# EAGLE design Dispenser (EAGLE 6.3)
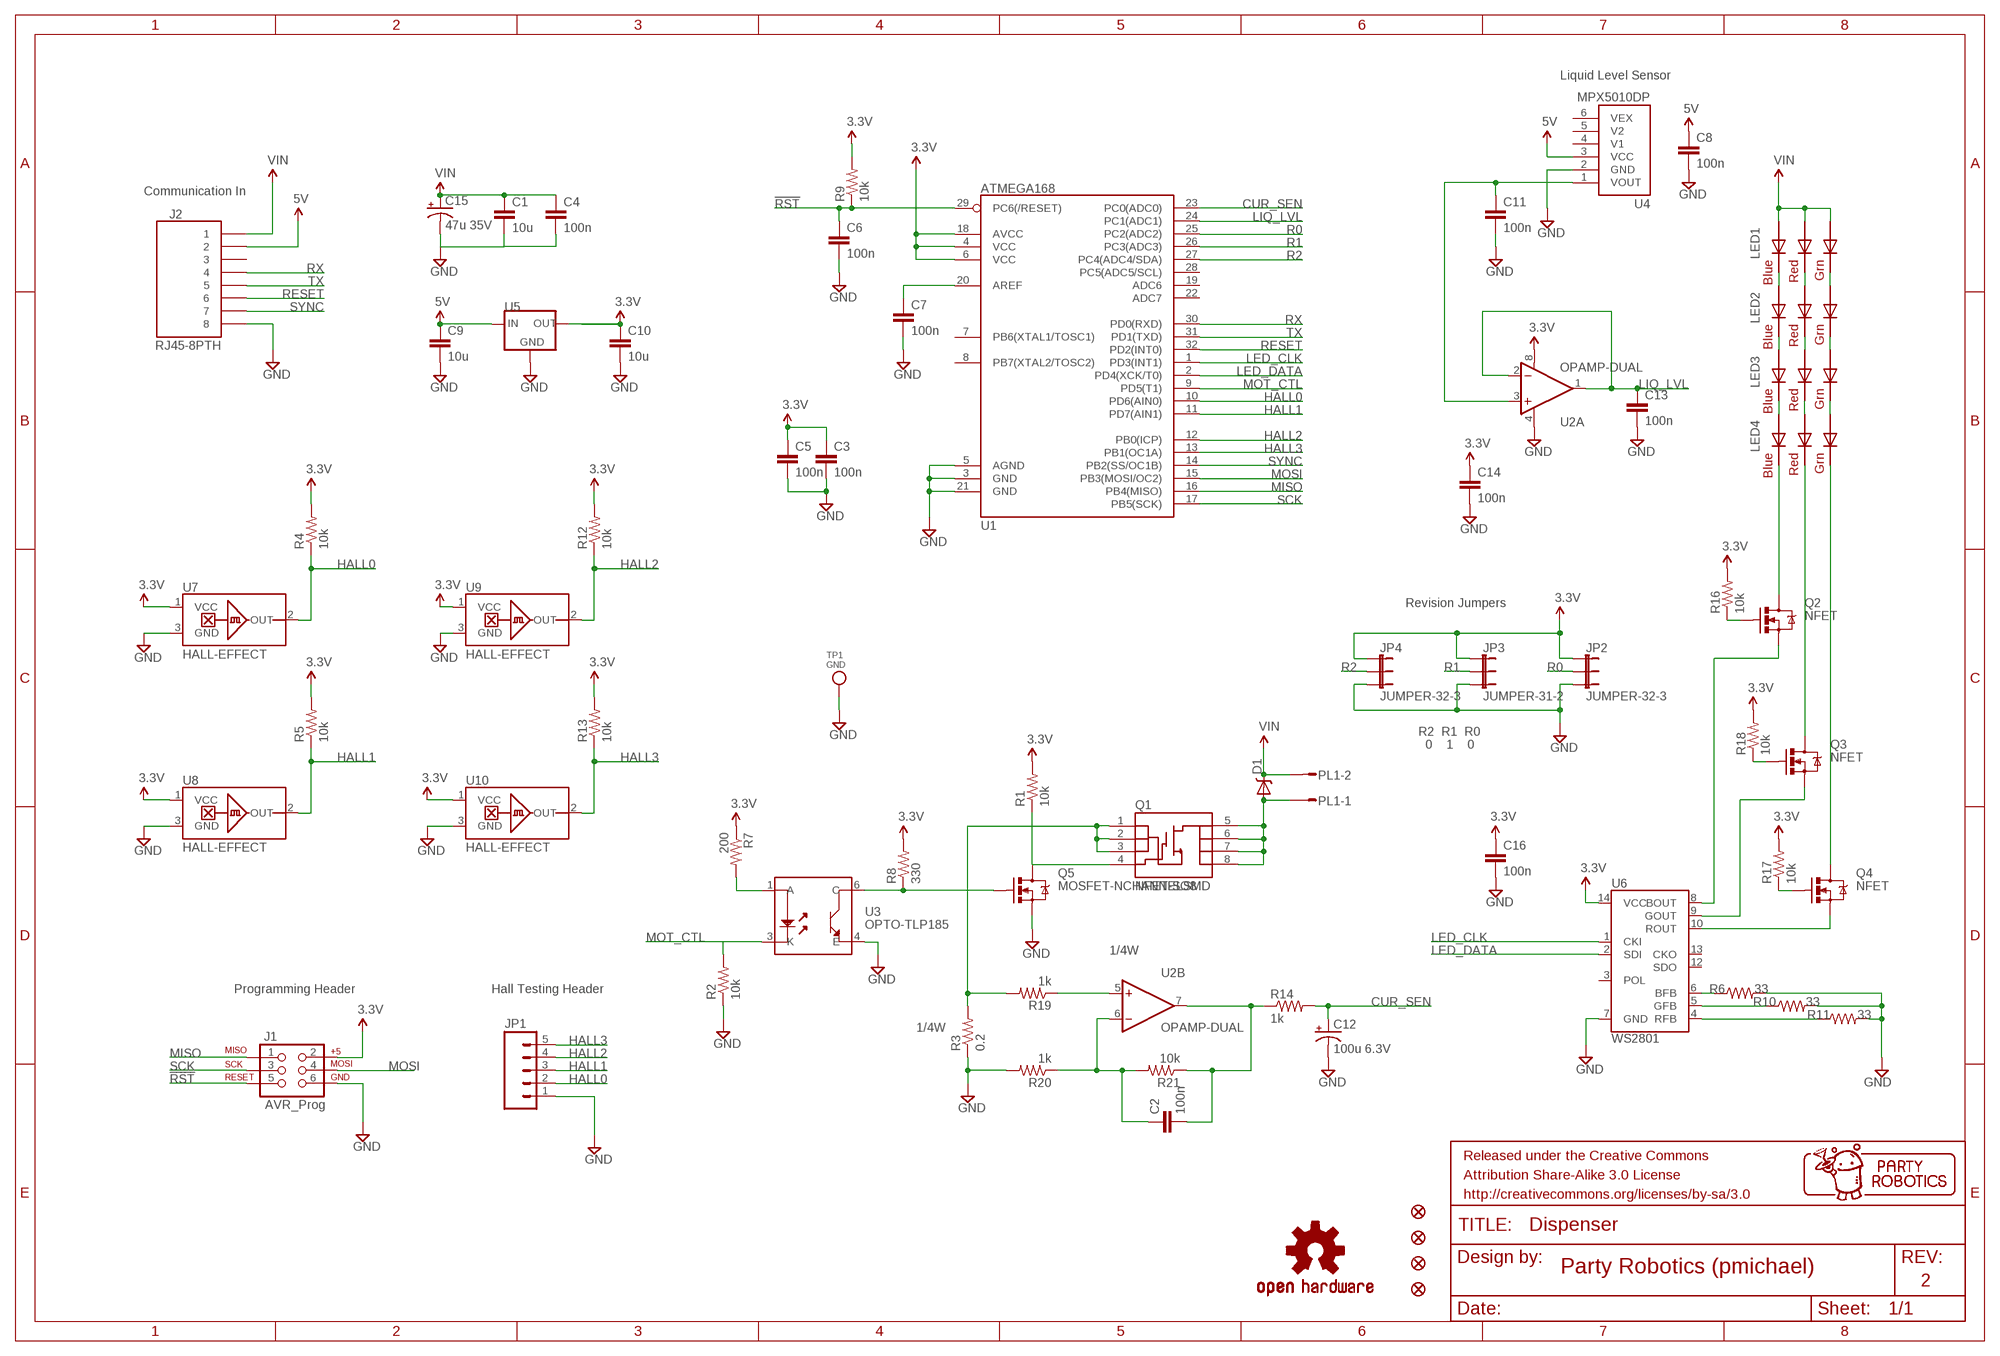
[diagram p0: schematic, sheet 1]

## Parts
C1  10u  CAP0603-CAP  [0603-CAP]
C2  100n  CAP0603-CAP  [0603-CAP]
C3  100n  CAP0603-CAP  [0603-CAP]
C4  100n  CAP0603-CAP  [0603-CAP]
C5  100n  CAP0603-CAP  [0603-CAP]
C6  100n  CAP0603-CAP  [0603-CAP]
C7  100n  CAP0603-CAP  [0603-CAP]
C8  100n  CAP0603-CAP  [0603-CAP]
C9  10u  CAP0603-CAP  [0603-CAP]
C10  10u  CAP0603-CAP  [0603-CAP]
C11  100n  CAP0603-CAP  [0603-CAP]
C12  100u 6.3V  CAP_POLD  [PANASONIC_D]
C13  100n  CAP0603-CAP  [0603-CAP]
C14  100n  CAP0603-CAP  [0603-CAP]
C15  47u 35V  CAP_POLD  [PANASONIC_D]
C16  100n  CAP0603-CAP  [0603-CAP]
D1  B330A  [SMA-DIODE]
FRAME3  FRAME-LETTER  [CREATIVE_COMMONS]
J1  AVR_Prog  AVR_SPI_PRG_62X3_LOCK  [2X3_LOCK]
J2  RJ45-8PTH  [RJ45-8]
JP1  M051.27MM  [1X05-1.27MM]
JP2  JUMPER-32-3  [SJ_3_PASTE2&3]
JP3  JUMPER-31-2  [SJ_3_PASTE1&2]
JP4  JUMPER-32-3  [SJ_3_PASTE2&3]
JP5  FIDUCIAL1X2  [FIDUCIAL-1X2]
JP6  FIDUCIAL1X2  [FIDUCIAL-1X2]
JP7  FIDUCIAL1X2  [FIDUCIAL-1X2]
JP8  FIDUCIAL1X2  [FIDUCIAL-1X2]
LED1  RGBLED5050  [RGBLED5050]
LED2  RGBLED5050  [RGBLED5050]
LED3  RGBLED5050  [RGBLED5050]
LED4  RGBLED5050  [RGBLED5050]
PL1  DF3-02P  [DF3P-02]
Q1  NFET-SO8  [SO08]
Q2  NFET  MOSFET-NCHANNELSMD  [SOT23-3]
Q3  NFET  MOSFET-NCHANNELSMD  [SOT23-3]
Q4  NFET  MOSFET-NCHANNELSMD  [SOT23-3]
Q5  MOSFET-NCHANNELSMD  [SOT23-3]
R1  10k  RESISTOR0603-RES  [0603-RES]
R2  10k  RESISTOR0603-RES  [0603-RES]
R3  0.2  RESISTOR0805-RES  [0805]
R4  10k  RESISTOR0603-RES  [0603-RES]
R5  10k  RESISTOR0603-RES  [0603-RES]
R6  33  RESISTOR0603-RES  [0603-RES]
R7  200  RESISTOR0603-RES  [0603-RES]
R8  330  RESISTOR0603-RES  [0603-RES]
R9  10k  RESISTOR0603-RES  [0603-RES]
R10  33  RESISTOR0603-RES  [0603-RES]
R11  33  RESISTOR0603-RES  [0603-RES]
R12  10k  RESISTOR0603-RES  [0603-RES]
R13  10k  RESISTOR0603-RES  [0603-RES]
R14  1k  RESISTOR0603-RES  [0603-RES]
R16  10k  RESISTOR0603-RES  [0603-RES]
R17  10k  RESISTOR0603-RES  [0603-RES]
R18  10k  RESISTOR0603-RES  [0603-RES]
R19  1k  RESISTOR0603-RES  [0603-RES]
R20  1k  RESISTOR0603-RES  [0603-RES]
R21  10k  RESISTOR0603-RES  [0603-RES]
TP1  GND  TESTPOINT  [TESTPOINT_SMT]
U1  ATMEGA168  [TQFP32-08]
U2  OPAMP-DUAL  OPAMP-DUALU  [SO08]
U3  OPTO-TLP185  [SO6]
U4  MPX5010DP  [MPX5010DP]
U5  VREG-5V-LDO-AP1117SOT89-3L  [SOT89-3L]
U6  WS2801  [SOP-14]
U7  HALL-EFFECT  [SOT23-3]
U8  HALL-EFFECT  [SOT23-3]
U9  HALL-EFFECT  [SOT23-3]
U10  HALL-EFFECT  [SOT23-3]
U$1  OSHW-LOGOM  [OSHW-LOGO-M]

## Nets
1/4W: Q1.1(S) Q1.2(S) Q1.3(S) R3.2 R19.2
3.3V: C3.1 C5.1 C8.1 C10.1 C14.1 C16.1 J1.2 JP2.1 JP3.1 JP4.1 R1.2 R4.2 R5.2 R7.1 R8.2 R9.2 R12.2 R13.2 R16.2 R17.2 R18.2 U1.4(VCC) U1.6(VCC) U1.18(AVCC) U2.8(A:V+) U5.2(OUT) U5.2.1(OUT) U6.14(VCC) U7.1(VCC) U8.1(VCC) U9.1(VCC) U10.1(VCC) ; supply symbol labelled 5V
5V: C9.1 J2.2 U4.3(VCC) U5.3(IN)
!RST: C6.1 J1.5 R9.1 U1.29(PC6(/RESET))
BLUE: Q2.2(S) U6.8(BOUT)
CUR_SEN: C12.+ R14.2 U1.23(PC0(ADC0))
GND: C1.2 C3.2 C4.2 C5.2 C6.2 C7.2 C8.2 C9.2 C10.2 C11.2 C12.- C13.2 C14.2 C15.- C16.2 J1.6 J2.8 JP1.1 JP2.3 JP3.3 JP4.3 Q5.2(S) R2.1 R3.1 R6.2 R10.2 R11.2 R20.2 TP1.P$1 U1.3(GND) U1.5(AGND) U1.21(GND) U2.4(A:V-) U3.4(E) U4.2(GND) U5.1(GND) U6.7(GND) U7.3(GND) U8.3(GND) U9.3(GND) U10.3(GND)
GREEN: Q3.2(S) U6.9(GOUT)
HALL0: JP1.2 R4.1 U1.10(PD6(AIN0)) U7.2(OUT)
HALL1: JP1.3 R5.1 U1.11(PD7(AIN1)) U8.2(OUT)
HALL2: JP1.4 R12.1 U1.12(PB0(ICP)) U9.2(OUT)
HALL3: JP1.5 R13.1 U1.13(PB1(OC1A)) U10.2(OUT)
LED_CLK: U1.1(PD3(INT1)) U6.1(CKI)
LED_DATA: U1.2(PD4(XCK/T0)) U6.2(SDI)
LIQ_LVL: C13.1 U1.24(PC1(ADC1)) U2.1(A:OUT) U2.2(A:-IN)
MISO: J1.1 U1.16(PB4(MISO))
MOSI: J1.4 U1.15(PB3(MOSI/OC2))
MOT_B: D1.A PL1.1 Q1.5(D) Q1.6(D) Q1.7(D) Q1.8(D)
MOT_CTL: R2.2 U1.9(PD5(T1)) U3.3(K)
MOT_CUR: C2.2 R14.1 R21.1 U2.7(B:OUT)
N$1: C7.1 U1.20(AREF)
N$2: Q3.1(G) R18.1
N$4: Q4.1(G) R17.1
N$5: Q2.1(G) R16.1
N$6: R6.1 U6.6(BFB)
N$7: R10.1 U6.5(GFB)
N$8: R11.1 U6.4(RFB)
N$9: Q1.4(G) Q5.3(D) R1.1
N$10: C2.1 R20.1 R21.2 U2.6(B:-IN)
N$11: R19.1 U2.5(B:+IN)
N$12: LED4.6(BLUE_C) Q2.3(D)
N$13: LED4.5(RED_C) Q3.3(D)
N$14: LED4.4(GREEN_C) Q4.3(D)
N$16: R7.2 U3.1(A)
N$17: Q4.2(S) U6.10(ROUT)
N$26: C11.1 U2.3(A:+IN) U4.1(VOUT)
N$28: LED3.6(BLUE_C) LED4.1(BLUE_A)
N$31: Q5.1(G) R8.1 U3.6(C)
N$34: LED3.5(RED_C) LED4.2(RED_A)
N$37: LED3.4(GREEN_C) LED4.3(GREEN_A)
N$38: LED2.4(GREEN_C) LED3.3(GREEN_A)
N$39: LED2.5(RED_C) LED3.2(RED_A)
N$40: LED2.6(BLUE_C) LED3.1(BLUE_A)
N$41: LED1.4(GREEN_C) LED2.3(GREEN_A)
N$42: LED1.5(RED_C) LED2.2(RED_A)
N$43: LED1.6(BLUE_C) LED2.1(BLUE_A)
R0: JP2.2 U1.25(PC2(ADC2))
R1: JP3.2 U1.26(PC3(ADC3))
R2: JP4.2 U1.27(PC4(ADC4/SDA))
RESET: J2.6 U1.32(PD2(INT0))
RX: J2.4 U1.30(PD0(RXD))
SCK: J1.3 U1.17(PB5(SCK))
SYNC: J2.7 U1.14(PB2(SS/OC1B))
TX: J2.5 U1.31(PD1(TXD))
VIN: C1.1 C4.1 C15.+ D1.C J2.1 LED1.1(BLUE_A) LED1.2(RED_A) LED1.3(GREEN_A) PL1.2
Unconnected: J2.3 U1.7(PB6(XTAL1/TOSC1)) U1.8(PB7(XTAL2/TOSC2)) U1.19(ADC6) U1.22(ADC7) U1.28(PC5(ADC5/SCL)) U4.4(V1) U4.5(V2) U4.6(VEX) U6.3(POL) U6.12(SDO) U6.13(CKO)

## Notes on the sheet
- Liquid Level Sensor
- Communication In
- Revision Jumpers
- R2  R1  R0
- 0    1    0
- Programming Header | Hall Testing Header
- Party Robotics (pmichael)
- 2
- C:/Users/Pierre/Dropbox/PartyRobotics/PartyRoboticsLogo/BW/Eagle-sch-logo.bmp

## Library data of the parts
C1 C9 C10 = SparkFun-Passives:CAP: Capacitor Standard 0603 ceramic capacitor, and 0.1" leaded capacitor.
C2-C8 C11 C13 C14 C16 = SparkFun:CAP: Capacitor Standard 0603 ceramic capacitor, and 0.1" leaded capacitor.
C12 C15 = SparkFun-Capacitors:CAP_POL: Capacitor Polarized These are standard SMD and PTH capacitors. Normally 10uF, 47uF, and 100uF in electrolytic and tantalum varieties. Always verify the external diameter of the through hole cap, it varies with capacity, voltage, and manufacturer. The EIA devices should be standard.
D1 = pierre:B330A: Schottky Diode 3A-30V; PROD_ID: DIO-09886
FRAME3 = SparkFun-Aesthetics:FRAME-LETTER: Schematic Frame Standard 8.5x11 US Letter frame
J1 = SparkFun-Connectors:AVR_SPI_PRG_6: AVR ISP 6 Pin This is the reduced ISP connector for AVR programming. Common on Arduino. This footprint will take up less PCB space and can be used with a 10-pin to 6-pin adapter such as SKU: BOB-08508
J2 = pierre:RJ45-8: RJ45 Jack Simple RJ45, 8-pin connection - connector for common Cat5, Cat5e, and Cat6 Ethernet cables. Footprint not yet proven in production. Connector sku is PRT-00643; Breakout PCB sku is BOB-00716.
JP1 = SparkFun:M05: Header 5 Standard 5-pin 0.1" header. Use with straight break away headers (SKU : PRT-00116), right angle break away headers (PRT-00553), swiss pins (PRT-00743), machine pins (PRT-00117), and female headers (PRT-00115). Molex polarized connector foot print use with SKU : PRT-08230 with associated crimp pins and housings.
JP2-JP4 = SparkFun-Passives:JUMPER-3
JP5-JP8 = SparkFun-Aesthetics:FIDUCIAL: Fiducial Alignment Points Various fiducial points for machine vision alignment.
LED1-LED4 = pierre:RGBLED: For 5050 RGB LEDs, the order of the LEDs may vary from one manufacturer to another!
PL1 = pierre:DF3-02: Single row connector 2mm 2 way
Q1 = pierre:NFET-SO8: IRF9410, NDS8434 & DMN3018SSS SOIC-8 parts.
Q2-Q5 = SparkFun-DiscreteSemi:MOSFET-NCHANNEL: Generic NMOS footprint
R1-R14 R16-R21 = SparkFun-Resistors:RESISTOR: Resistor Basic schematic elements and footprints for 0603, 1206, and PTH resistors.
TP1 = microbuilder:TESTPOINT: Test Point Various test points for characterisation and PCB testing TESTPOINT_SMT - Compact Surface Mount Test Point [Digikey: 5016KTR-ND]
U1 = SparkFun-DigitalIC:ATMEGA168: Atmel 32-pin 8-bit micro, 16k flash.
U2 = SparkFun-AnalogIC:OPAMP-DUAL: Generic op-amp footprint
U3 = pierre:OPTO-TLP185
U4 = pierre:MPX5010DP
U5 = pierre:VREG-5V-LDO-AP1117
U6 = SparkFun-DigitalIC:WS2801: WS2801 3 Channel Constant Current LED Driver with programmable PWM outputs. Datasheet: http://www.sparkfun.com/datasheets/Components/LED/WS2801.pdf
U7-U10 = pierre:HALL-EFFECT: Hall effect sensor in SC70 package
U$1 = pierre:OSHW-LOGO: Open Source Hardware Logo This logo indicates the piece of hardware it is found on incorporates a OSHW license and/or adheres to the definition of open source hardware found here: http://freedomdefined.org/OSHW

## Board
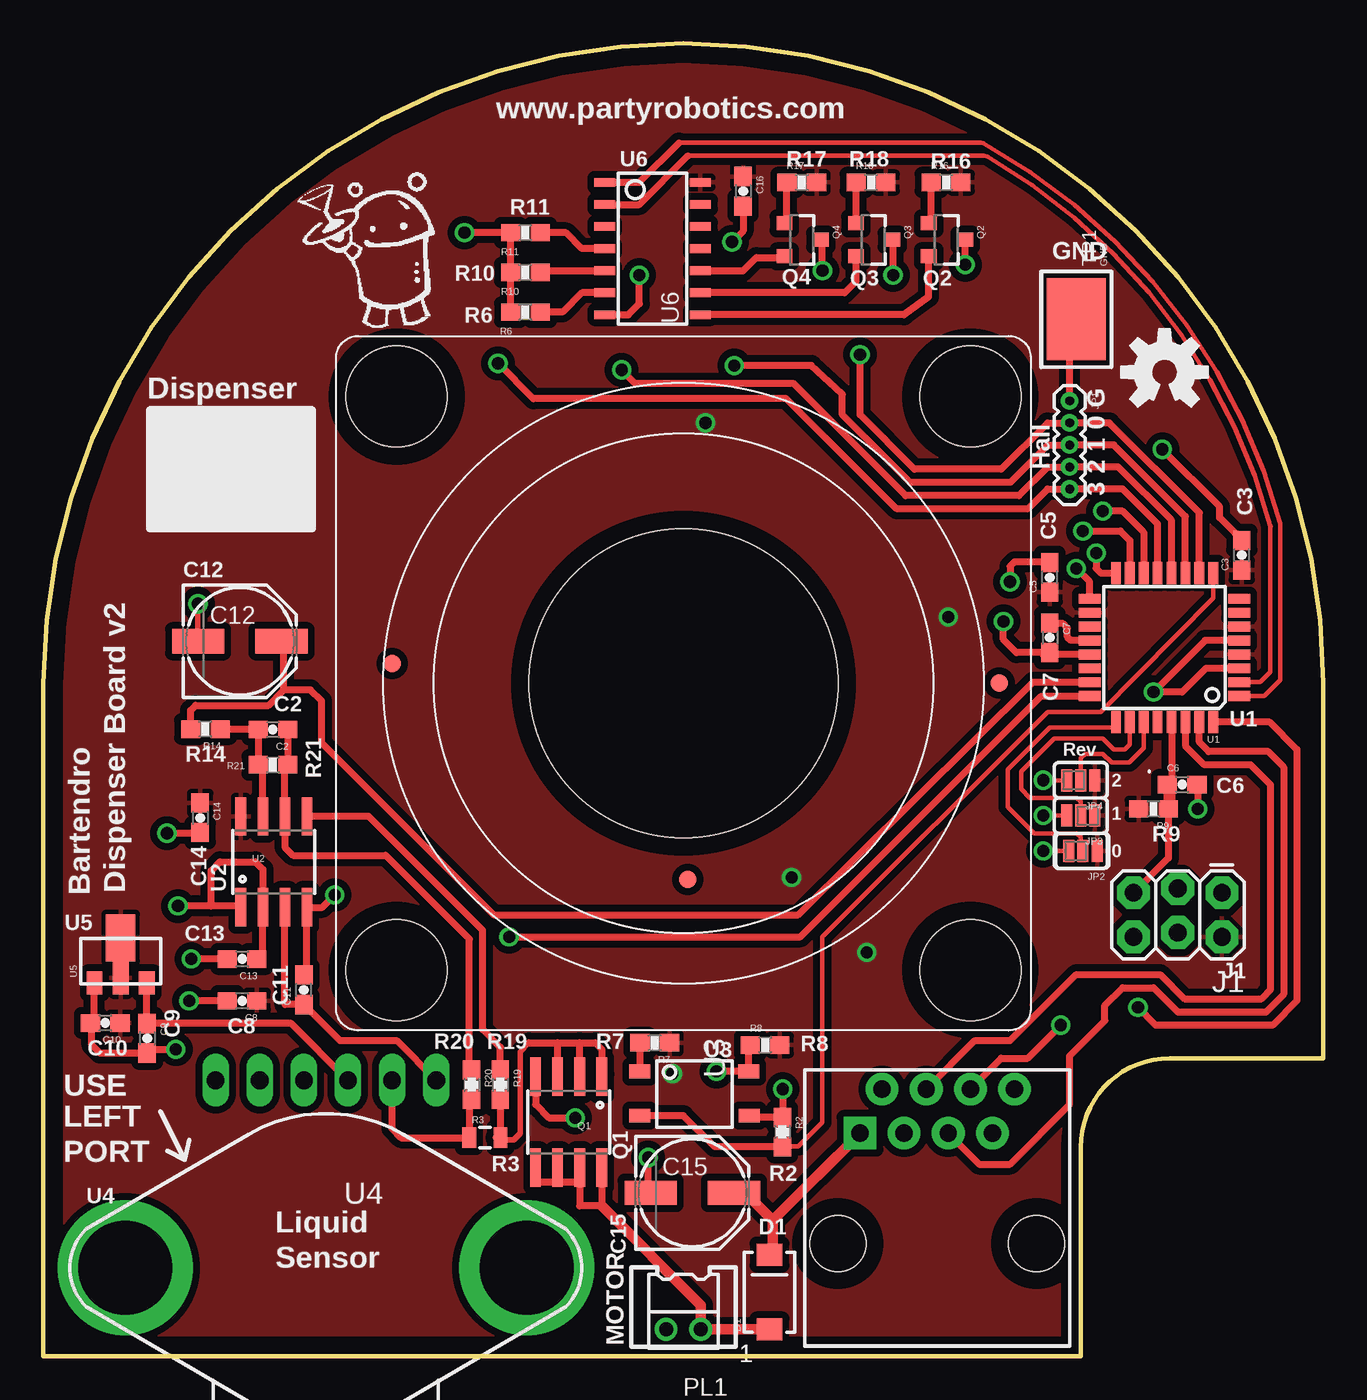
[diagram p1: board, top side]
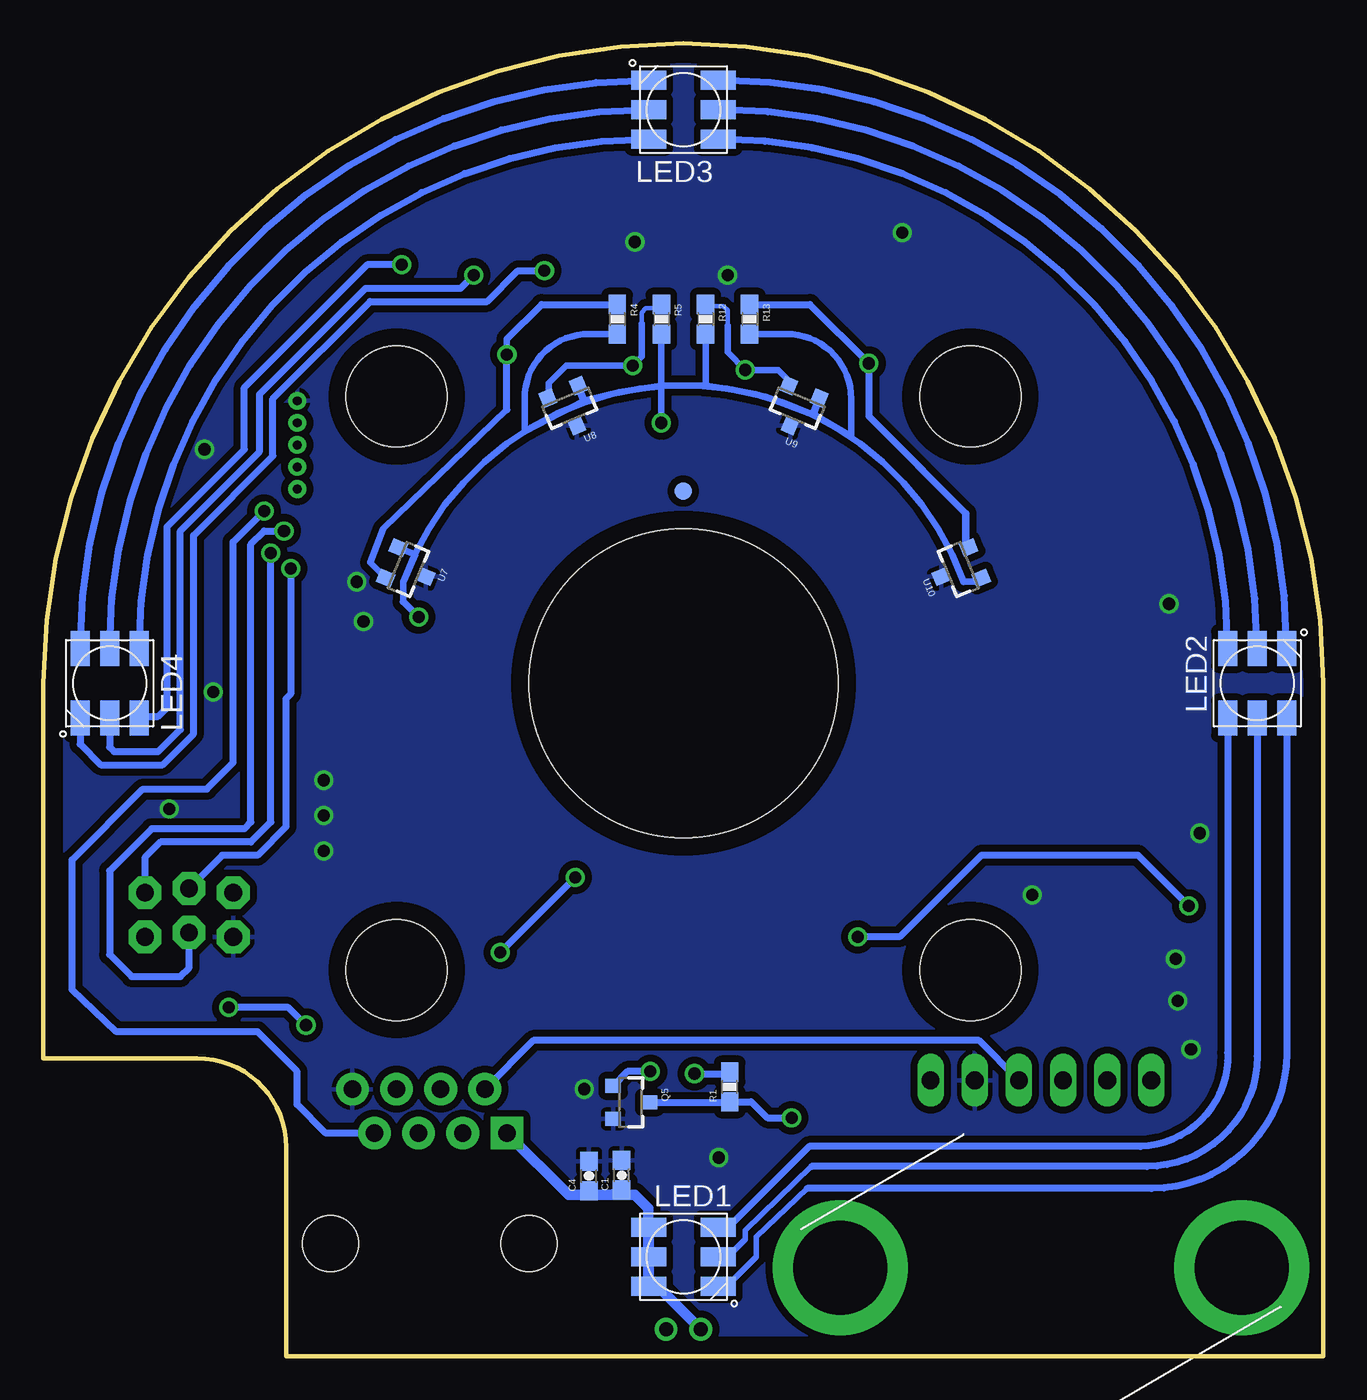
[diagram p2: board, bottom side, seen from below]

Size 73.66 x 75.56 mm. Coordinates in mm from the lower left corner, seen from the top.
Outline: 73.66,38.73 73.66,17.14 64.81,17.14 arc90 59.69,12.03 59.69,0 0,0 0,38.73 arc-180 73.66,38.73
Copper layers (1*16): Top 0.035mm / dielectric 1.5mm / Bottom 0.035mm
Design rules "default": minimum track width 10mil, minimum drill 24mil, track to track 8mil, track to pad 8mil, pad to pad 8mil, via to via 8mil, smd to smd 8mil, copper to edge 40mil, drill to drill 8mil, minimum pad ring 10mil, minimum via ring 8mil, stop-mask expansion 4mil, vias tented up to drill 0mil, thermal gap 10mil
Holes 5.79 mm at 20.32,55.24 53.34,55.24 20.32,22.23 53.34,22.23
Holes 17.78 mm at 36.83,38.73

### Footprints (pad centres in the part's own frame; a part is rotated, then mirrored left to right if it is on the bottom)
0603-CAP = smd 1.1 x 1: 1 -0.85,0; 2 0.85,0
PANASONIC_D = smd 3 x 1.4: + 2.4,0; - -2.4,0
SMA-DIODE = smd 1.27 x 1.47: A -2.15,0; C 2.15,0
2X3_LOCK = drill 1.016 pad 1.88 octagon: 1 0,0; 2 0,2.54; 3 2.54,-0.254; 4 2.54,2.286; 5 5.08,0; 6 5.08,2.54
RJ45-8 = drill 1 pad 1.88 square: 1 -4.445,6.35 | drill 1 pad 1.88: 2 -3.175,8.89; 3 -1.905,6.35; 4 -0.635,8.89; 5 0.635,6.35; 6 1.905,8.89; 7 3.175,6.35; 8 4.445,8.89 | hole 3.2: -5.715,0; 5.715,0
1X05-1.27MM = drill 0.508 pad 1: 1 0,0; 2 1.27,0; 3 2.54,0; 4 3.81,0; 5 5.08,0
SJ_3_PASTE2&3 = smd 0.635 x 1.27: 1 -0.813,0; 2 0,0; 3 0.813,0
SJ_3_PASTE1&2 = smd 0.635 x 1.27: 1 -0.813,0; 2 0,0; 3 0.813,0
FIDUCIAL-1X2 = smd 1 x 1: 1 0,0
RGBLED5050 = smd 2 x 1.1: 1 -2,1.7; 2 -2,0; 3 -2,-1.7; 4 2,-1.7; 5 2,0; 6 2,1.7
DF3P-02 = drill 0.8: 1 -1,1; 2 1,1
SO08 = smd 0.61 x 2.21: 1 -1.905,-2.616; 2 -0.635,-2.616; 3 0.635,-2.616; 4 1.905,-2.616; 5 1.905,2.616; 6 0.635,2.616; 7 -0.635,2.616; 8 -1.905,2.616
SOT23-3 = smd 0.8 x 0.9: 1 -0.95,-1; 2 0.95,-1; 3 0,1.1
0603-RES = smd 1.1 x 1: 1 -0.85,0; 2 0.85,0
0805 = smd 0.8 x 1.2: 1 -0.9,0; 2 0.9,0
TESTPOINT_SMT = smd 4.7 x 3.4: P$1 0,0
TQFP32-08 = smd 1.27 x 0.559: 1 -4.293,2.8; 2 -4.293,2; 3 -4.293,1.2; 4 -4.293,0.4; 5 -4.293,-0.4; 6 -4.293,-1.2; 7 -4.293,-2; 8 -4.293,-2.8; 17 4.293,-2.8; 18 4.293,-2; 19 4.293,-1.2; 20 4.293,-0.4; 21 4.293,0.4; 22 4.293,1.2; 23 4.293,2; 24 4.293,2.8 | smd 0.559 x 1.27: 9 -2.8,-4.293; 10 -2,-4.293; 11 -1.2,-4.293; 12 -0.4,-4.293; 13 0.4,-4.293; 14 1.2,-4.293; 15 2,-4.293; 16 2.8,-4.293; 25 2.8,4.293; 26 2,4.293; 27 1.2,4.293; 28 0.4,4.293; 29 -0.4,4.293; 30 -1.2,4.293; 31 -2,4.293; 32 -2.8,4.293
SO6 = smd 0.8 x 1.2: 1 -1.27,-3.15; 3 1.27,-3.15; 4 1.27,3.15; 6 -1.27,3.115
MPX5010DP = drill 1.016 long: 1 -6.35,1.905; 2 -3.81,1.905; 3 -1.27,1.905; 4 1.27,1.905; 5 3.81,1.905; 6 6.35,1.905 | drill 5.41 pad 7.772: P1 11.557,12.7; P2 -11.557,12.7
SOT89-3L = smd 0.9 x 1.3: 1 -1.5,-1.25; 3 1.5,-1.25 | smd 0.9 x 1.9: 2 0,-0.95 | smd 1.7 x 2.7: 2.1 0,1.35
SOP-14 = smd 0.5 x 1.2: 1 -3.81,-2.75; 2 -2.54,-2.75; 3 -1.27,-2.75; 4 0,-2.75; 5 1.27,-2.75; 6 2.54,-2.75; 7 3.81,-2.75; 8 3.81,2.75; 9 2.54,2.75; 10 1.27,2.75; 11 0,2.75; 12 -1.27,2.75; 13 -2.54,2.75; 14 -3.81,2.75

### Placement (x,y rotation side)
C1  40.39,10.41 90 bottom
C2  13.21,36.07 180 top
C3  68.96,46.1 90 top
C4  42.27,10.36 90 bottom
C5  57.91,44.83 90 top
C6  65.53,32.89 0 top
C7  57.91,41.35 270 top
C8  11.43,20.45 180 top
C9  5.97,18.29 270 top
C10  3.56,19.18 180 top
C11  14.99,21.08 90 top
C12  11.3,41.15 0 top
C13  11.43,22.86 180 top
C14  9.02,30.99 270 top
C15  37.34,9.4 0 top
C16  40.26,67.06 270 top
D1  41.78,3.68 90 top
FRAME3  18.41,84.2 0 top  (outside the outline)
J1  67.82,26.67 180 top
J2  51.44,6.48 0 top
JP1  59.05,54.99 270 top
JP2  59.82,29.08 180 top
JP3  59.69,31.11 180 top
JP4  59.69,33.15 180 top
JP5  20.07,39.88 0 top
JP6  36.83,49.78 0 bottom
JP7  54.99,38.73 0 top
JP8  37.08,27.43 0 top
LED1  36.83,5.71 0 bottom
LED2  3.81,38.73 90 bottom
LED3  36.83,71.75 180 bottom
LED4  69.85,38.73 270 bottom
PL1  36.83,2.54 180 top
Q1  30.23,13.46 180 top
Q2  51.94,64.26 270 top
Q3  47.75,64.26 270 top
Q4  43.64,64.26 270 top
Q5  39.88,14.61 270 bottom
R1  34.16,15.49 90 bottom
R2  42.52,12.9 270 top
R3  25.4,12.57 0 top
R4  40.64,59.69 270 bottom
R5  38.1,59.69 270 bottom
R6  27.74,60.1 180 top
R7  35.18,18.03 180 top
R8  41.53,17.91 0 top
R9  63.88,31.5 180 top
R10  27.74,62.38 180 top
R11  27.74,64.67 180 top
R12  35.56,59.69 270 bottom
R13  33.02,59.69 270 bottom
R14  9.32,36.09 180 top
R16  51.94,67.56 0 top
R17  43.64,67.56 0 top
R18  47.62,67.56 0 top
R19  26.29,15.62 270 top
R20  24.64,15.62 270 top
R21  13.21,34.04 0 top
TP1  59.44,59.69 90 top
U1  64.52,40.79 180 top
U2  13.26,28.45 0 top
U3  37.47,15.11 270 top
U4  16.26,17.78 180 top
U5  4.45,22.73 0 top
U6  35.05,63.75 270 top
U7  52.68,45.29 247.5 bottom
U8  43.38,54.58 202.5 bottom
U9  30.28,54.58 157.5 bottom
U10  20.98,45.29 112.5 bottom
U$1  64.52,56.64 0 top

### Tracks (layer width: path | path; a pad name or v marks a point on that pad's centre or on a via)
1/4W
  Top 0.305: 26.29,12.45 27.05,12.45 27.43,12.83 27.43,17.53 27.94,18.03
  Top 0.406: 32.27,16.22 Q1.1 32.13,17.65 31.75,18.03 30.86,18.03 | R19.2 26.29,12.44 | 26.29,12.44 R3.2 | 26.29,12.44 26.04,12.57 26.29,12.45 | 27.94,18.03 29.59,18.03 | 29.59,18.03 30.86,18.03 | Q1.2 30.86,18.03 | Q1.3 29.59,18.03
3.3V  (via drill 0.7, 0.7 pad 0.61)
  Bottom 0.254: 52.96,44.58 52.93,44.6
  Bottom 0.381: U10.1 19.91,44.58 20.7,44.58 | 42.93,55.83 U8.1 42.55,54.99 | R4.2 42.25,58.84 arc-90 45.97,55.12 45.97,53.21 42.55,54.99 | R13.2 30.9,58.84 arc90 27.18,55.12 27.18,52.96 29.34,54.23 U9.1 | 20.73,44.6 arc-140 52.93,44.6 52.27,46.15 U7.1 | 52.96,44.58 52.96,43.43 | 38.1,55.88 35.56,55.88 | R12.2 35.56,55.88 | 35.56,55.88 34.04,55.63 32.13,55.24 29.39,54.2 | 38.1,55.88 40.51,55.5 42.55,54.99 | R5.2 38.1,55.88 | 38.1,55.88 v38.1,53.72
  Bottom 0.406: 52.96,43.43 v52.07,42.55 | R13.2 33.02,58.8 | R12.2 35.56,58.93 | v43.05,27.56 v47.37,23.24 | U9.1 29.39,54.2 | 42.93,55.83 42.55,54.91 | 20.73,44.6 20.7,44.58 | v36.2,16.26 34.25,16.26 R1.2
  pour Top (isolate 0.406): 0,0 0,75.56 74.3,75.56 74.3,17.14 64.77,17.14 59.69,12.06 59.69,0
5V
  Top 0.406: U4.3 14.26,19.14 C9.1 5.95,19.16 U5.3
  Bottom 0.406: U4.3 19.81,18.16 45.47,18.16 J2.2
!RST
  Top 0.406: U1.29 64.92,31.68 | 64.92,31.68 R9.1 64.73,28.66 J1.5 | 64.92,31.68 64.68,31.91 C6.1
BLUE
  Top 0.406: Q2.2 50.93,63.3 50.93,60.96 49.53,59.94 U6.8
CUR_SEN
  Top 0.254: 14.48,41.66 13.97,41.15 C12.+
  Top 0.406: U1.23 56.95,38.79 43.43,25.4 25.91,25.4 16,35.31 16,37.72 15.37,38.35 13.84,38.35 | R14.2 8.47,37.17 8.76,37.47 12.95,37.47 13.84,38.35 | 13.84,38.35 13.84,41.01 C12.+
GND  (via drill 0.7)
  Top 0.254: 68.85,41.15 U1.5 | JP4.3 v57.53,33.15 | JP3.3 v57.53,31.11 | JP2.3 v57.53,29.08
  Top 0.305: 57.42,45.72 C5.2 | C12.- 8.89,41.16 v8.89,43.31
  Top 0.406: JP1.1 59.05,59.18 arc-90 TP1.P$1 | v24.23,64.67 R11.2 R10.2 R6.2 | U6.7 33.66,59.94 34.29,60.58 v34.29,62.23 | C13.2 v8.51,22.86 | C8.2 v8.38,20.45 | U1.21 57.52,40.39 C7.2 55.99,40.5 55.24,41.25 v55.24,42.29 55.26,42.3 | U1.5 66.85,41.19 v63.88,38.23 65.53,38.23 66.9,39.59 U1.3 | v16.76,26.54 16.05,25.83 U2.4 15.16,22.01 C11.2 | 57.42,45.72 55.88,45.72 55.63,45.47 v55.63,44.58 | 68.96,46.99 C3.2 68.58,47.37 67.69,48.26 67.69,48.9 v64.39,52.2 | R20.2 24.5,14.91 R3.1 20.57,12.57 20.07,13.08 U4.2 | C14.2 8.98,30.1 v7.11,30.1 | C16.2 40.26,64.77 v39.62,64.14 | v7.62,17.65 6.18,17.65 C9.2 3.26,17.44 2.79,17.91 2.79,19.09 C10.2 2.71,19.22 2.92,19.43 2.92,21.46 U5.1 | 40.7,13.75 R2.1 42.56,13.72 v42.55,15.37 | C15.- 34.8,9.4 v34.8,11.43 | C6.2 66.42,32.85 v66.42,31.5
  Top 0.61: 40.7,13.75 U3.4
  pour Bottom (isolate 0.406, rank 2): 0,0 0,75.56 74.3,75.56 74.3,17.14 65.41,17.14 59.69,11.43 59.69,0
GREEN
  Top 0.406: Q3.2 46.75,61.87 46.1,61.21 U6.9
HALL0  (via drill 0.7)
  Top 0.406: U1.10 66.52,48.55 61.34,53.72 JP1.2 57.78,53.72 55.12,51.05 50.13,51.05 46.99,54.19 v46.99,57.66
  Bottom 0.381: U7.2 54.86,45.69 54.1,47.62 46.99,54.48 | v46.99,57.66 46.99,58.55 | 40.64,60.45 R4.1
  Bottom 0.406: 46.99,58.55 45,60.54 R4.1 | 46.99,54.48 v46.99,57.66
HALL1  (via drill 0.7)
  Top 0.406: U1.11 65.72,48.33 61.59,52.45 JP1.3 57.78,52.45 55.63,50.29 49.87,50.29 45.97,54.19 45.97,55.37 44.2,57.02 v39.75,57.02
  Bottom 0.254: 39.24,59.44 39.24,60.07 38.99,60.33 38.35,60.33
  Bottom 0.381: 44.58,55.63 44.58,56.01 43.56,57.02 v39.75,57.02 39.24,57.53 39.24,59.44 | 38.23,60.33 38.35,60.33
  Bottom 0.406: 44.58,55.63 44.58,55.21 U8.2 | 38.23,60.33 38.23,60.41 R5.1
HALL2  (via drill 0.7)
  Top 0.406: U1.12 64.92,48.11 61.85,51.18 JP1.4 57.78,51.18 56.13,49.53 49.62,49.53 43.14,56.01 34.04,56.01 v33.27,56.77
  Bottom 0.254: 34.29,59.31 34.29,60.2 34.54,60.45 35.47,60.45 R12.1
  Bottom 0.305: U9.2 30.73,55.91 30.73,56.13
  Bottom 0.381: 34.29,59.31 34.29,57.78 v33.27,56.77 31.37,56.77 30.73,56.13
HALL3  (via drill 0.7)
  Top 0.406: U1.13 64.12,47.9 62.1,49.91 JP1.5 57.78,49.91 56.64,48.77 49.11,48.77 42.76,55.12 28.19,55.12 v26.16,57.15
  Bottom 0.406: R13.1 29.55,60.54 v26.16,57.15 26.16,54.1 20.57,48.51 20.57,46.7 U10.2
LED_CLK
  Top 0.254: U1.1 70.25,37.99 71.17,38.91 71.17,47.93 arc46 54.08,69.83 53.98,69.85 36.58,69.85
  Top 0.406: U6.1 34.29,67.56 36.58,69.85
LED_DATA
  Top 0.254: U1.2 70.03,38.79 70.61,39.37 70.61,47.75 arc90 70.61,47.78 arc45 54.33,69.04 54.15,69.09 37.08,69.09
  Top 0.406: U6.2 34.29,66.29 37.08,69.09
LIQ_LVL  (via drill 0.7)
  Top 0.406: C13.1 12.62,23.2 U2.2 12.62,28.02 12.19,28.45 10.16,28.45 9.65,27.94 9.65,25.91 | U2.1 11.28,25.91 9.65,25.91 | v26.8,24.13 43.56,24.13 57.42,37.99 U1.24 | 9.65,25.91 v7.75,25.91
  Bottom 0.406: v7.75,25.91 10.67,28.83 19.68,28.83 24.38,24.13 v26.8,24.13
MISO  (via drill 0.7)
  Top 0.406: 61.72,45.47 U1.16 60.83,45.09 60.58,45.34 v60.58,46.23
  Bottom 0.406: v60.58,46.23 60.58,30.73 61.72,29.59 66.93,29.59 67.82,28.7 J1.1
MOSI  (via drill 0.7)
  Top 0.406: v59.82,47.5 61.98,47.5 62.52,46.96 U1.15
  Bottom 0.406: v59.82,47.5 60.96,47.5 61.72,46.74 61.72,30.73 62.1,30.35 67.44,30.35 69.85,27.94 69.85,23.11 68.58,21.84 65.79,21.84 65.28,22.35 J1.4
MOT_B
  Top 0.406: Q1.7 30.86,10.03 | Q1.6 29.59,10.03 | 30.86,10.03 30.86,8.64 32.13,8.64 Q1.8 32.21,10.92 | Q1.5 28.32,10.03 29.59,10.03 | 29.59,10.03 30.86,10.03
  Top 0.61: 32.13,8.64 37.83,2.94 PL1.1 D1.A 41.54,1.54
MOT_CTL
  Top 0.254: U1.9 67.32,43.64 60.83,37.08 57.78,37.08 44.83,24.13 44.83,13.46 43.43,12.06 42.53,12.06 R2.2
  Top 0.406: R2.2 38.62,12.05 36.83,13.84 U3.3
MOT_CUR
  Top 0.406: U2.7 12.62,33.77 R21.1 C2.2 10.2,36.07 R14.1
N$1
  Top 0.406: U1.20 59.14,41.19 58.93,41.4 58.93,41.91 58.67,42.16 57.95,42.16 C7.1
N$2
  Top 0.406: Q3.1 46.77,65.23 R18.1
N$3
  Bottom 0.406: 20.57,46.74 20.57,48.51 25.4,53.34
N$4
  Top 0.406: Q4.1 42.79,65.36 R17.1
N$5
  Top 0.406: 50.94,67.46 R16.1 51.09,65.36 Q2.1
N$6
  Top 0.406: U6.6 30.99,61.21 29.87,60.1 R6.1
N$7
  Top 0.406: R10.1 28.69,62.48 U6.5
N$8
  Top 0.406: U6.4 30.99,63.75 30.07,64.67 R11.1
N$9  (via drill 0.7 pad 0.61)
  Top 0.406: Q1.4 28.32,14.48 29.08,13.72 v30.61,13.72
  Bottom 0.406: v30.61,13.72 32,13.72 32.93,14.64 R1.1 34.2,14.61 Q5.3
N$10
  Top 0.406: R20.1 24.51,16.6 24.51,24 19.68,28.83 14.35,28.83 13.89,29.29 U2.6 13.89,34 R21.2 C2.1
N$11
  Top 0.406: R19.1 26.29,17.78 25.27,18.8 25.27,24.51 18.72,31.06 U2.5
N$12  (via drill 0.7)
  Top 0.406: v53.04,62.82 Q2.3
  Bottom 0.406: LED4.6 68.06,36.83 67.06,36.83 66.55,37.34 66.55,47.75 62.1,52.2 62.1,55.75 55.03,62.82 v53.04,62.82
N$13  (via drill 0.7)
  Top 0.406: v48.9,62.23 48.9,64.22 Q3.3
  Bottom 0.406: LED4.5 69.85,35.05 69.6,34.8 67.06,34.8 65.79,36.07 65.79,47.5 61.21,52.07 61.21,55.37 55.12,61.47 49.66,61.47 v48.9,62.23
N$14  (via drill 0.7)
  Top 0.406: v44.83,62.48 44.83,64.17 Q4.3
  Bottom 0.406: LED4.4 71.55,35.23 70.36,34.04 66.8,34.04 65.02,35.81 65.02,47.24 60.45,51.82 60.45,55.12 54.86,60.71 48.13,60.71 46.35,62.48 v44.83,62.48
N$16
  Top 0.406: R7.2 34.33,16.4 U3.1
N$17
  Top 0.406: U6.10 40.26,62.48 41.02,63.25 42.57,63.25 Q4.2
N$26
  Top 0.406: U2.3 13.89,20.23 C11.1 17.06,18.16 20.32,18.16 U4.1
N$28
  Bottom 0.406: LED4.1 arc90 LED3.6
N$31  (via drill 0.7 pad 0.61)
  Top 0.406: R8.1 40.58,17.81 U3.6 v38.73,16.38
  Bottom 0.406: v38.73,16.38 40.05,16.38 Q5.1
N$34
  Bottom 0.406: LED4.2 arc90 LED3.5
N$37
  Bottom 0.406: LED4.3 arc90 LED3.4
N$38
  Bottom 0.406: LED2.4 arc-90 LED3.3
N$39
  Bottom 0.406: LED2.5 arc-90 LED3.2
N$40
  Bottom 0.406: LED2.6 arc-90 LED3.1
N$41
  Bottom 0.305: LED1.4 34.83,4.03 34.8,4.06 34.29,4.06 32.64,5.71 32.64,6.86 29.72,9.65
  Bottom 0.406: LED2.3 2.11,17.45 arc90 9.91,9.65 29.72,9.65
N$42
  Bottom 0.305: 29.46,10.92 33.27,7.24 33.27,6.73 34.16,5.84 34.7,5.84 LED1.5
  Bottom 0.406: LED2.2 3.81,17.27 arc90 10.16,10.92 29.46,10.92
N$43
  Bottom 0.406: LED2.1 5.51,17.48 arc90 10.54,12.06 29.59,12.06 34.24,7.42 LED1.6
R0
  Top 0.254: U1.25 61.72,36.2 57.91,36.2 55.5,33.78 55.5,31.62 57.02,30.1 59.48,30.1 59.69,29.88 59.69,29.08 JP2.2
R1
  Top 0.254: 62.48,36.47 U1.26 62.52,35.21 62.23,34.92 61.59,34.92 60.96,35.56 58.17,35.56 56.26,33.66 56.26,32.64 56.77,32.13 59.48,32.13 59.69,31.92 JP3.2
R2
  Top 0.254: U1.27 63.32,34.99 62.48,34.16 61.47,34.16 60.96,34.67 59.94,34.67 59.69,34.42 JP4.2
RESET  (via drill 0.7)
  Top 0.406: J2.6 55.12,17.14 56.64,17.14 v58.55,19.05 | v62.99,20.07 64.01,19.05 70.74,19.05 72.14,20.45 72.14,34.92 70.56,36.5 U1.32
  Bottom 0.406: v58.55,19.05 59.56,20.07 v62.99,20.07
RX
  Top 0.406: U1.30 65.72,35.12 66.8,34.04 69.47,34.04 70.61,32.89 70.61,21.08 70.1,20.57 65.66,20.57 64.26,21.97 59.44,21.97 55.63,18.16 53.59,18.16 J2.4
SCK  (via drill 0.7)
  Top 0.406: U1.17 arc-90 60.2,43.62 60.2,44.58 v59.44,45.34
  Bottom 0.406: v59.44,45.34 59.44,38.1 59.69,37.85 59.69,30.48 61.34,28.83 63.37,28.83 J1.3
SYNC  (via drill 0.7)
  Top 0.406: U1.14 63.32,47.43 62.1,48.64 v60.96,48.64
  Bottom 0.406: J2.7 57.4,12.83 59.05,14.48 59.05,16.38 61.34,18.67 69.47,18.67 72.01,21.08 72.01,28.57 67.94,32.64 64.26,32.64 62.74,34.16 62.74,46.86 v60.96,48.64
TX
  Top 0.406: J2.5 53.85,11.05 55.63,11.05 59.05,14.48 59.05,17.27 61.09,19.3 61.09,20.19 62.1,21.21 63.88,21.21 65.28,19.81 70.36,19.81 71.37,20.83 71.37,33.91 70.48,34.8 67.06,34.8 66.52,35.34 U1.31
VIN
  Top 0.61: 44.45,10.29 J2.1 41.97,7.81 | C15.+ 40.39,9.4 41.97,7.81 | 41.97,7.81 41.97,6.02 D1.C
  Bottom 0.61: LED1.3 LED1.2 LED1.1 | LED1.3 38.86,4.01 38.86,8.51 39.62,9.27 40.98,9.27 | 40.98,9.27 42.51,9.27 | 40.98,9.27 C1.1 | J2.1 43.43,9.27 42.51,9.27 | 42.51,9.27 C4.1 | LED1.3 38.3,4.01 PL1.2

### Text on the board
_tsilk: Released under the Creative Commons Attribution Share-Alike 3.0 License | http://creativecommons.org/licenses/by-sa/3.0 | Designed by: Pierre Michael and Robert Kaye | www.partyrobotics.com | U6 | R17 | R18 | R16 | R11 | R10 | GND | Q4 | Q3 | Q2 | R6 | Dispenser | G | 0 | 1 | Hall | 2 | 3 | C3 | C5 | C12 | C7 | C2 | U1 | R14 | Rev | R21 | 2 | C6 | 1 | R9 | C14 | 0 | Bartendro | Dispenser Board v2 | U2 | C13 | U5 | J1 | C9 | C11 | C8 | R20 | R19 | R7 | C10 | U3 | R8 | USE | LEFT | PORT | R3 | Q1 | R2 | U4 | Liquid | D1 | C15 | Sensor | MOTOR | 1
_bsilk: LED3 | R13 | R5 | R4 | R12 | U8 | U9 | U7 | U10 | LED4 | LED2 | R1 | Q5 | C4 | C1 | LED1
200bmp: C16 | TP1 | JP1 | PL1